# Altium schematic sheet DAC.Schematic.SchDoc
size A
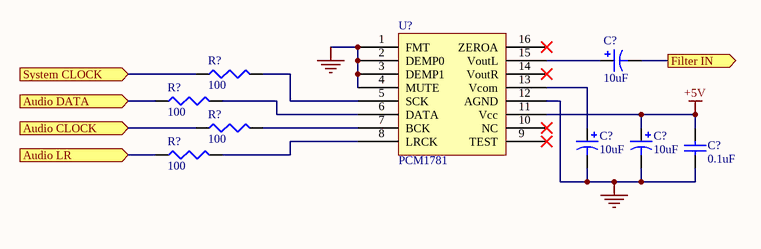
[diagram p0: DAC.Schematic.SchDoc]

## Parts
(Parts that share a designator on the sheet are numbered #1, #2 ... from top to bottom, then left to right.)
C?#1  10uF  [RB7.6-15]
C?#2  10uF  [RB7.6-15]
C?#3  10uF  [RB7.6-15]
C?#4  0.1uF  [C1206]
R?#1  100  [J1-0603]
R?#2  100  [J1-0603]
R?#3  100  [J1-0603]
R?#4  100  [J1-0603]
U?  PCM1781

## Ports
Audio CLOCK (in), Audio DATA (in), Audio LR (in), Filter IN (out), System CLOCK (in)

## Nets
+5V: C?#3.1 C?#4.2 U?.11(Vcc)
NetC?#2_2: C?#2.2 C?#3.2 C?#4.1 U?.1(FMT) U?.2(DEMP0) U?.3(DEMP1) U?.4(MUTE) U?.12(AGND)
Audio CLOCK: R?#3.1 ; port Audio CLOCK
Audio DATA: R?#2.1 ; port Audio DATA
Audio LR: R?#4.1 ; port Audio LR
Filter IN: C?#1.2 ; port Filter IN
System CLOCK: R?#1.1 ; port System CLOCK
NetC?#1_1: C?#1.1 U?.15(VoutL)
NetC?#2_1: C?#2.1 U?.13(Vcom)
NetR?#1_2: R?#1.2 U?.5(SCK)
NetR?#2_2: R?#2.2 U?.6(DATA)
NetR?#3_2: R?#3.2 U?.7(BCK)
NetR?#4_2: R?#4.2 U?.8(LRCK)

Not connected (* = marked no-connect by the designer): U? 9(TEST)* 10(NC)* 14(VoutR)* 16(ZEROA)*

## Library data of the parts
C?#1-C?#3 = Cap Pol1: Polarized Capacitor (Radial); Published: 8-Jun-2000; LatestRevisionDate: 17-Jul-2002; LatestRevisionNote: Re-released for DXP Platform.; PackageReference: RB7.6-15; Publisher: Altium Limited; PackageDescription: Polarized Capacitor (Radial); 2 Leads; Value: 10uF
C?#4 = Cap Semi: Capacitor (Semiconductor SIM Model); Value: 0.1u; Published: 8-Jun-2000; LatestRevisionDate: 29-May-2009; LatestRevisionNote: IPC-7351 Footprint Added.; PackageReference: C1206; Publisher: Altium Limited; PackageDescription: Chip Capacitor
R?#1-R?#4 = Res3: Resistor; Published: 8-Jun-2000; LatestRevisionDate: 29-May-2009; LatestRevisionNote: IPC-7351 Footprint Added.; PackageReference: J1-0603; Publisher: Altium Limited; PackageDescription: Chip Resistor; Value: 100
U? = PCM1781 DAC